# Altium schematic sheet 08.AUDIO.SchDoc: CM3 IO
size 246 x 182 mm; Page Create Date: March  8, 1995; Page Number: 08; Page Size: A; Comment: radxa_1010; Page Count: 20; RevCode: 1.36; Doc: AUDIO; DsnPath: D:\WMS\黄工\[RC119]CM3_IO_V1.36\对外资料\radxa_cm3_io_board_v1360.DSN; SchematicName: CM3_IO V1.36; PageName: 08.AUDIO; PageSize: A; TopSchematic: True
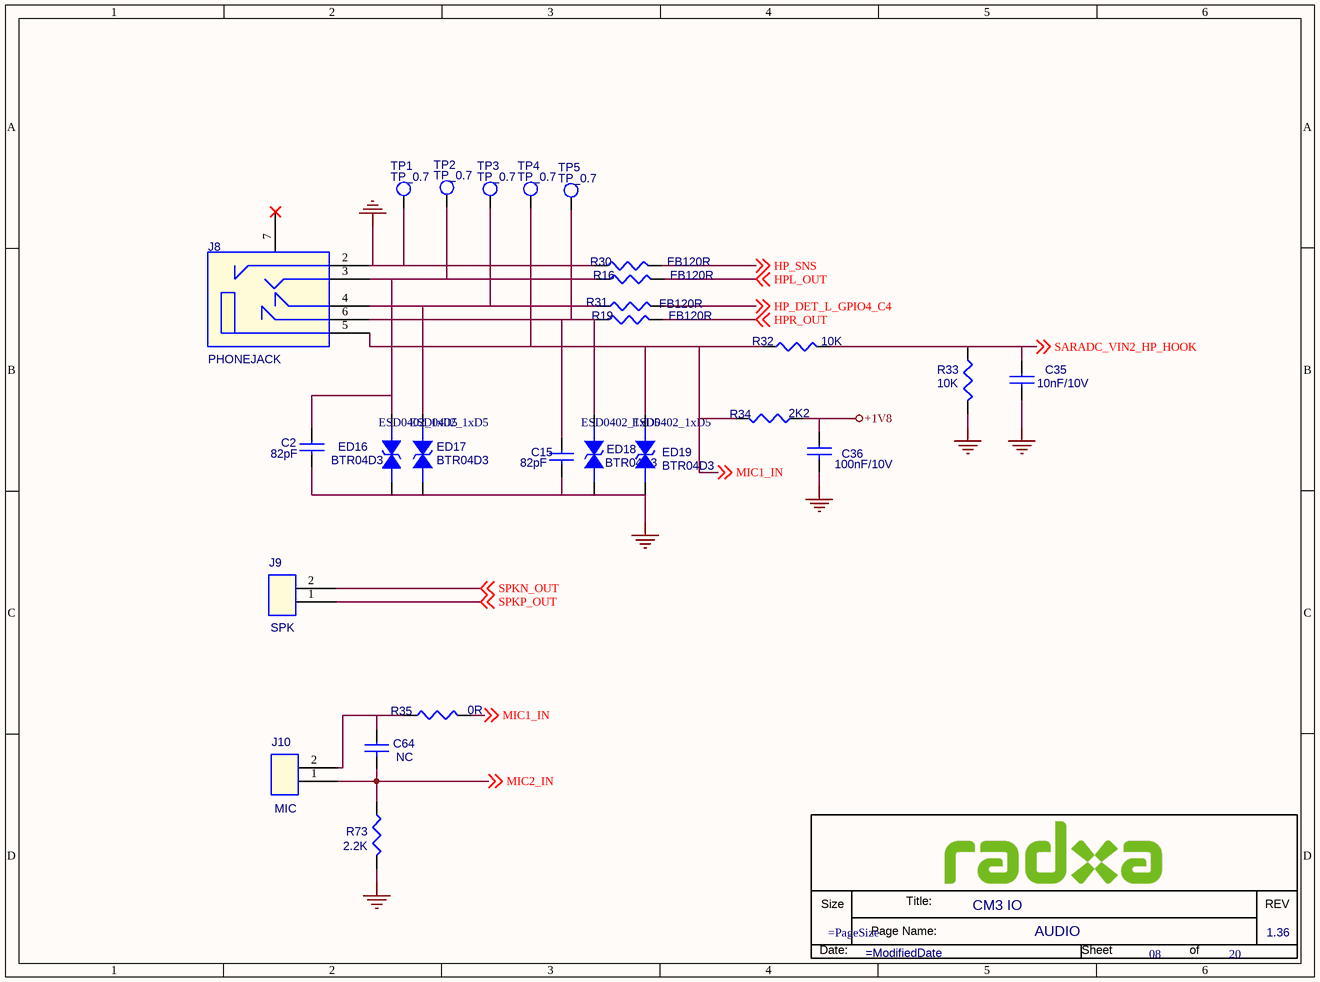
[diagram p0: 08.AUDIO.SchDoc]

## Parts
*  Doc: AUDIO  RevCode: 1.36  Title: CM3 IO  Page Number: 08  Page Count: 20  (hidden comment: radxa_1010)  (graphical)
C2  82pF  [C0402]
C15  82pF  [C0402]
C35  10nF/10V  [C0402]
C36  100nF/10V  [C0402]
C64  NC  [C0402]
ED16  BTR04D3  [ESD0402_1xD5]
ED17  BTR04D3  [ESD0402_1xD5]
ED18  BTR04D3  [ESD0402_1xD5]
ED19  BTR04D3  [ESD0402_1xD5]
J8  PHONEJACK  [PJ-327A]
J9  SPK  [DIP2PIN-2P54MM]
J10  MIC  [DIP2PIN-2P54MM]
R16  FB120R  [R0402]
R19  FB120R  [R0402]
R30  FB120R  [R0402]
R31  FB120R  [R0402]
R32  10K  [R0402]
R33  10K  [R0402]
R34  2K2  [R0402]
R35  0R  [R0402]
R73  2.2K  [R0402]
TP1  TP_0.7  [TEST]
TP2  TP_0.7  [TEST]
TP3  TP_0.7  [TEST]
TP4  TP_0.7  [TEST]
TP5  TP_0.7  [TEST]

## Nets
+1V8: C36.1 R34.2
GND: C2.2 C15.2 C35.2 C36.2 ED16.2 ED17.2 ED18.2 ED19.2 J8.2(DH) R30.1 R33.1 R73.1 TP1.1
HP_DET_L_GPIO4_C4: R31.2 ; off-sheet HP_DET_L_GPIO4_C4
HP_SNS: R30.2 ; off-sheet HP_SNS
HPL_OUT: R16.2 ; off-sheet HPL_OUT
HPR_OUT: R19.2 ; off-sheet HPR_OUT
MIC1_IN: ED19.1 J8.5(D) R32.2 R34.1 R35.2 TP4.1 ; off-sheet MIC1_IN
MIC2_IN: C64.2 J10.1 R73.2 ; off-sheet MIC2_IN
SARADC_VIN2_HP_HOOK: C35.1 R32.1 R33.2 ; off-sheet SARADC_VIN2_HP_HOOK
SPKN_OUT: J9.2 ; off-sheet SPKN_OUT
SPKP_OUT: J9.1 ; off-sheet SPKP_OUT
NetC2_1: C2.1 ED16.1 J8.3(R) R16.1 TP2.1
NetC15_1: C15.1 ED18.1 J8.6(HP) R19.1 TP5.1
NetC64_1: C64.1 J10.2 R35.1
NetED17_1: ED17.1 J8.4(L) R31.1 TP3.1

Not connected (* = marked no-connect by the designer): J8 7(NC2)*

## Notes on the sheet
- (in symbol radxa_1010) Size; Title:; REV; Page Name:; Date:; Sheet; of

## Library data of the parts
C2 = CAP: RoHS CHIP CAP 0.1uF +10/-10% X7R; Part Reference: C2; Value: 82pF; PCB Footprint: C0402
C15 = CAP: RoHS CHIP CAP 0.1uF +10/-10% X7R; Part Reference: C15; Value: 82pF; PCB Footprint: C0402
C35 = CAP: RoHS CHIP CAP 0.01uF +10/-10% X7R; Part Reference: C35; Value: 10nF/10V; PCB Footprint: C0402
C36 = CAP: RoHS CHIP CAP 0.1uF +10/-10% X7R; Part Reference: C36; Value: 100nF/10V; PCB Footprint: C0402
C64 = CAP: RoHS CHIP CAP 0.01uF +10/-10% X7R; Part Reference: C64; Value: NC; PCB Footprint: C0402
ED16 = DIODE BI_DIR TRIG_0: 1-Line, Bi-directional, Transient Voltage Suppressors.17.5pF.; Part Reference: ED16; Manufacturer: WillSemi(韦尔半导体); RK PN: ESD5451N; Priority: A; PCB Footprint: ESD0402_1xD5; Value: BTR04D3; Part Type: ESD_TVS; Manufacturer PN: ESD5451N; Created by: JJJ
ED17 = DIODE BI_DIR TRIG_0: 1-Line, Bi-directional, Transient Voltage Suppressors.17.5pF.; Part Reference: ED17; Manufacturer PN: ESD5451N; Manufacturer: WillSemi(韦尔半导体); Priority: A; PCB Footprint: ESD0402_1xD5; Value: BTR04D3; Created by: JJJ; Part Type: ESD_TVS; RK PN: ESD5451N
ED18 = DIODE BI_DIR TRIG_0: 1-Line, Bi-directional, Transient Voltage Suppressors.17.5pF.; Part Reference: ED18; Manufacturer PN: ESD5451N; Manufacturer: WillSemi(韦尔半导体); Priority: A; PCB Footprint: ESD0402_1xD5; Value: BTR04D3; Created by: JJJ; Part Type: ESD_TVS; RK PN: ESD5451N
ED19 = DIODE BI_DIR TRIG_0: 1-Line, Bi-directional, Transient Voltage Suppressors.17.5pF.; Part Reference: ED19; Manufacturer: WillSemi(韦尔半导体); RK PN: ESD5451N; Priority: A; PCB Footprint: ESD0402_1xD5; Value: BTR04D3; Part Type: ESD_TVS; Manufacturer PN: ESD5451N; Created by: JJJ
J8 = PHONEJACK STEREO SW_0: 耳插; Part Reference: J8; BOM_VALUE: 0; BOM_TYPE: 60; Value: PHONEJACK; PCB Footprint: PJ-327A
J9 = CON2: Part Reference: J9; Value: SPK; PCB Footprint: DIP2PIN-2P54MM
J10 = CON2: Part Reference: J10; Value: MIC; PCB Footprint: DIP2PIN-2P54MM
R16 = RESISTOR_0: 通用厚膜电阻,0R,+/-5%,R0402,1/16W.; Part Reference: R16; Manufacturer: YAGEO; RK PN: RC0402JR-070RL; Priority: A; Tolerance: 5%; Wattage: 1/16W; Value: FB120R; Part Type: 通用厚膜电阻; Manufacturer PN: RC0402JR-070RL; Created by: YTL; PCB Footprint: R0402
R19 = RESISTOR_0: 通用厚膜电阻,0R,+/-5%,R0402,1/16W.; Part Reference: R19; Manufacturer PN: RC0402JR-070RL; Manufacturer: YAGEO; Wattage: 1/16W; Tolerance: 5%; Priority: A; Value: FB120R; Created by: YTL; Part Type: 通用厚膜电阻; RK PN: RC0402JR-070RL; PCB Footprint: R0402
R30 = RESISTOR_0: 通用厚膜电阻,0R,+/-5%,R0402,1/16W.; Part Reference: R30; Manufacturer: YAGEO; RK PN: RC0402JR-070RL; Priority: A; Tolerance: 5%; Wattage: 1/16W; Value: FB120R; Part Type: 通用厚膜电阻; Manufacturer PN: RC0402JR-070RL; Created by: YTL; PCB Footprint: R0402
R31 = RESISTOR_0: 通用厚膜电阻,0R,+/-5%,R0402,1/16W.; Part Reference: R31; Manufacturer PN: RC0402JR-070RL; Manufacturer: YAGEO; Wattage: 1/16W; Tolerance: 5%; Priority: A; Value: FB120R; Created by: YTL; Part Type: 通用厚膜电阻; RK PN: RC0402JR-070RL; PCB Footprint: R0402
R32 = RESISTOR: ROHS CHIP RES 0R 1/16W 5%; Part Reference: R32; Value: 10K; PCB Footprint: R0402
R33 = RESISTOR: ROHS CHIP RES 0R 1/16W 5%; Part Reference: R33; Value: 10K; PCB Footprint: R0402
R34 = RESISTOR: ROHS CHIP RES 2K2 1/16W 5%; Part Reference: R34; Value: 2K2; PCB Footprint: R0402
R35 = RESISTOR_0: 通用厚膜电阻,0R,+/-5%,R0402,1/16W.; Part Reference: R35; Manufacturer: YAGEO; RK PN: RC0402JR-070RL; Priority: A; Tolerance: 5%; Wattage: 1/16W; Value: 0R; Part Type: 通用厚膜电阻; Manufacturer PN: RC0402JR-070RL; Created by: YTL; PCB Footprint: R0402
R73 = RESISTOR: ROHS CHIP RES 0R 1/16W 5%; Part Reference: R73; Value: 2.2K; PCB Footprint: R0402
TP1 = TP: Test Point 0.7mm; Part Reference: TP1; PCB Footprint: TP_0R70; RK PN: TESTPOINT_0R7; Priority: A; Value: TP_0.7; Part Type: TP; Created by: JJJ
TP2 = TP: Test Point 0.7mm; Part Reference: TP2; PCB Footprint: TP_0R70; Priority: A; RK PN: TESTPOINT_0R7; Value: TP_0.7; Created by: JJJ; Part Type: TP
TP3 = TP: Test Point 0.7mm; Part Reference: TP3; PCB Footprint: TP_0R70; RK PN: TESTPOINT_0R7; Priority: A; Value: TP_0.7; Part Type: TP; Created by: JJJ
TP4 = TP: Test Point 0.7mm; Part Reference: TP4; PCB Footprint: TP_0R70; Priority: A; RK PN: TESTPOINT_0R7; Value: TP_0.7; Created by: JJJ; Part Type: TP
TP5 = TP: Test Point 0.7mm; Part Reference: TP5; PCB Footprint: TP_0R70; RK PN: TESTPOINT_0R7; Priority: A; Value: TP_0.7; Part Type: TP; Created by: JJJ
* = radxa_1010: Page Create Date: March  8, 1995; Page Size: =PageSize; Page Modify Date: =ModifiedDate